# Altium schematic sheet Power.SchDoc
size A4; Author: T. Kreppel; CompanyName: Technische Universität München; Organization: TUM EAL; Address1: Arcisstraße 21; Address2: 80333 München; Address3: GERMANY; SheetNumber: 6; SheetTotal: 6; CompanyName2: Lehrstuhl für Elektrische Antriebsrechnik u. Leistungselektronik
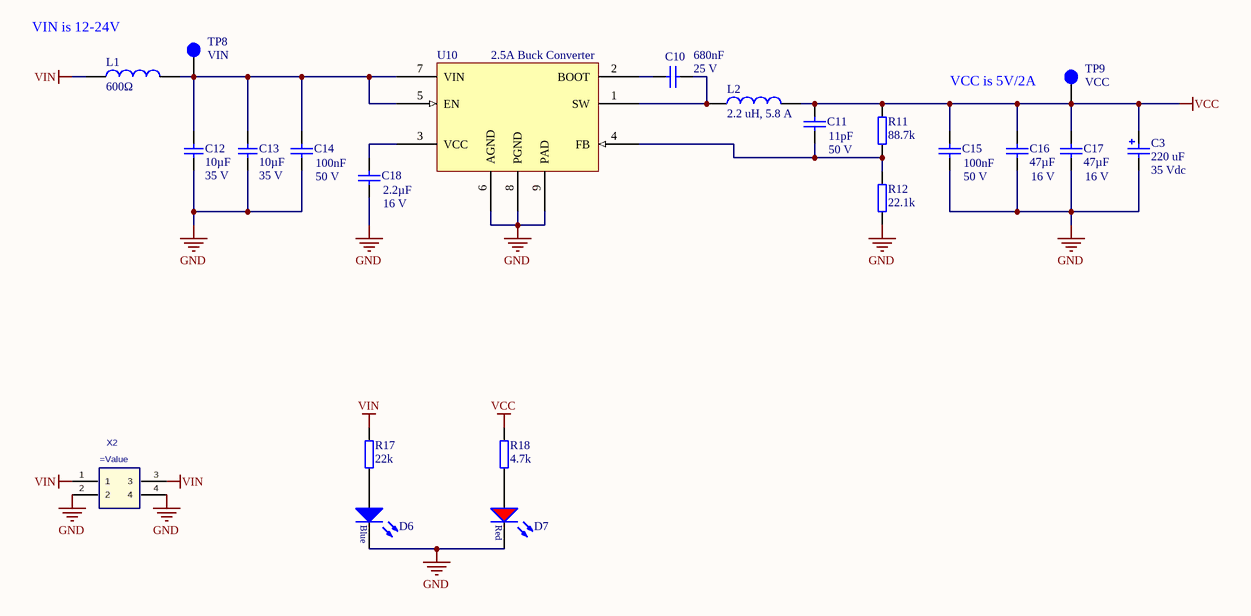
[diagram p0: Power.SchDoc]

## Parts
C3  220 uF  Voltage: 35 Vdc  [WCAP-ATG5_8x11.5x3.5]
C10  Voltage: 25 V  [C_0603(1608)100_L]  (hidden comment: 680nF)
C11  Voltage: 50 V  [C_0603(1608)100_L]  (hidden comment: 11pF)
C12  10µF  Voltage: 35 V  [C_1206]
C13  10µF  Voltage: 35 V  [C_1206]
C14  Voltage: 50 V  [C_0603(1608)100_L]  (hidden comment: 100nF)
C15  Voltage: 50 V  [C_0603(1608)100_L]  (hidden comment: 100nF)
C16  47µF  Voltage: 16 V  [C_1210_N]
C17  47µF  Voltage: 16 V  [C_1210_N]
C18  Voltage: 16 V  [C_0603(1608)100_L]  (hidden comment: 2.2µF)
D6  150060BS75000  [WL-SMCW_0603]  (value not drawn)
D7  150060RS75000  [WL-SMCW_0603]  (value not drawn)
L1  600Ω  [WE-CBF_0805_High Current]
L2  2.2 uH, 5.8 A  [SDC Inductor 4x4x2]
R11  88.7k  [R_0603_N]
R12  22.1k  [R_0603_N]
R17  22k  [R_0603_N]
R18  4.7k  [R_0603_N]
TP8  VIN  [TP_1mm]
TP9  VCC  [TP_1mm]
U10  2.5A Buck Converter  [SOP127P600X170_HS-9N]
X2  (no value)  [IPL1-102-01-L-D-K]

## Nets
GND: C3.2(N) C12.1 C13.1 C14.2 C15.1 C16.1 C17.1 C18.2 D6.1(K) D7.1(K) R12.1 U10.6(AGND) U10.8(PGND) U10.9(PAD) X2.2 X2.4
VCC: C3.1(P) C11.2 C15.2 C16.2 C17.2 L2.2 R11.2 R18.2 TP9.1
VIN: L1.1 R17.2 X2.1 X2.3
NetC10_1: C10.1 U10.2(BOOT)
NetC10_2: C10.2 L2.1 U10.1(SW)
NetC11_1: C11.1 R11.1 R12.2 U10.4(FB)
NetC12_2: C12.2 C13.2 C14.1 L1.2 TP8.1 U10.5(EN) U10.7(VIN)
NetC18_1: C18.1 U10.3(VCC)
NetD6_2: D6.2(A) R17.1
NetD7_2: D7.2(A) R18.1

## Notes on the sheet
- (near L1) VIN is 12-24V
- VCC is 5V/2A
- Title
- Size:
- Date:
- A4
- Revision:
- Time:
- Sheet
- of
- Author:
- Project:

## Library data of the parts
C3 = 860020574012: WCAP-ATG5 Aluminum Electrolytic Capacitors, 8x11.5mm, 35 Vdc, 220 uF; MF: Wurth Elektronik; ComponentLink1Description: Manufacturer; ComponentLink1URL: http://www.we-online.de; ComponentLink2Description: Datasheet; ComponentLink2URL: http://katalog.we-online.com/pbs/datasheet/860020574012.pdf; Part Number: 860020574012; Published Date: Sep. 2017; Size: 8x11.5mm; Life Cycle: 2000h; Operating Temperature: -40 °C up to +105 °C; Value: 220 uF; MPN: 860020574012; Supplier 1: Mouser; Supplier Part Number 1: 710-860020574012
C10 = C_0603: CAP 0603 (1608 Metric) SMD; MPN: 0603X684K250CT; Tolerance: ±10%; Case-Metric: 1608; Dielectric: X5R; Case-EIA: 0603; MF: Walsin; Max Thickness: 1 mm; Technology: SMT; Value: 680nF; Created: 2018_09_06_AGeiger; Supplier 1: Mouser; Supplier Part Number 1: 791-0603X684K250CT; Package: 0603
C11 = C_0603: CAP 0603 (1608 Metric) SMD; MPN: CC0603JRNPO9BN110; Tolerance: ±5%; Case-Metric: 1608; Dielectric: C0G; Case-EIA: 0603; MF: Yageo; Max Thickness: 1 mm; Technology: SMT; Value: 11pF; Created: 2018_09_06_AGeiger; Supplier 1: Mouser; Supplier Part Number 1: 603-CC603JRNPO9BN110; Package: 0603
C12 C13 = C_1206: Capacitor 1206; MPN: GMK316BJ106KL-T; Tolerance: 10%; MF: Taiyo Yuden; Dielectric: X5R; Package: 1206; Value: 10µF; Created: 2018_06_25_AGeiger; Supplier 1: Mouser; Supplier Part Number 1: 963-GMK316BJ106KL-T
C14 C15 = C_0603: CAP 0603 (1608 Metric) SMD; MPN: CC0603MRY5V9BB104; Tolerance: ±20%; Case-Metric: 1608; Dielectric: X5V; Case-EIA: 0603; MF: Yageo; Max Thickness: 0.8 mm; Technology: SMT; Value: 100nF; Created: 2018_09_06_AGeiger; Supplier 1: Mouser; Supplier Part Number 1: 603-C0603MRY5V9BB104; Package: 0603
C16 C17 = C_1210: Capacitor 1210; MPN: GRM32EC81C476ME15L; Dielectric: X6S; MF: Murata; Tolerance: 20%; Created: 2018_11_12_AGeiger; Package: 1210; Supplier 1: Mouser; Supplier Part Number 1: 81-GRM32EC81C476ME5L; Value: 47µF
C18 = C_0603: CAP 0603 (1608 Metric) SMD; MPN: EMK107BJ225KA-T; Tolerance: ±10%; Case-Metric: 1608; Dielectric: X5R; Case-EIA: 0603; MF: Taiyo Yuden; Max Thickness: 1 mm; Technology: SMT; Value: 2.2µF; Created: 2018_09_06_AGeiger; Supplier 1: Mouser; Supplier Part Number 1: 963-EMK107BJ225KA-T; Package: 0603
D6 = LED_Blue_0603: WL-SMCW SMD Mono-color Chip LED Waterclear, size 0603, Blue, 3.2 V, 140°; Forward Voltage: 3.2 V; Luminous Intensity: 145 mcd; Peak Wavelength: 465 nm; Dominant Wavelength: 470 nm; MF: Wuerth Elektronik; Published Date: Sep. 2017; ComponentLink1Description: Manufacturer; ComponentLink1URL: http://www.we-online.de; ComponentLink2Description: Datasheet; ComponentLink2URL: http://katalog.we-online.com/led/datasheet/150060BS75000.pdf; MPN: 150060BS75000; Size: 0603; Viewing Angle: 140°; Emitting Color: Blue; Value: 150060BS75000; Package: 0603; Created: 2018_09_06_AGeiger; Supplier 1: Farnell; Supplier Part Number 1: 2322069; Supplier 2: Mouser; Supplier Part Number 2: 710-150060BS75000; Supplier 3: Digi-Key; Supplier Part Number 3: 732-4966-1-ND
D7 = LED_Red_0603: WL-SMCW SMD Mono-color Chip LED Waterclear, size 0603, Red, 2 V, 140°; Forward Voltage: 2 V; Luminous Intensity: 250 mcd; Peak Wavelength: 630 nm; Dominant Wavelength: 625 nm; MF: Wuerth Elektronik; Published Date: Sep. 2017; ComponentLink1Description: Manufacturer; ComponentLink1URL: http://www.we-online.de; ComponentLink2Description: Datasheet; ComponentLink2URL: http://katalog.we-online.com/led/datasheet/150060RS75000.pdf; MPN: 150060RS75000; Size: 0603; Viewing Angle: 140°; Emitting Color: Red; Value: 150060RS75000; Package: 0603; Created: 2018_09_06_AGeiger; Supplier 1: Farnell; Supplier Part Number 1: 2322071; Supplier 2: Mouser; Supplier Part Number 2: 710-150060RS75000; Supplier 3: Digi-Key; Supplier Part Number 3: 732-4978-1-ND
L1 = WE-CBF, 742792040: WE-CBF SMD EMI Suppression Ferrite Bead, 0805, 600Ω; MF: Wurth Elektronik; Type: High Current; PublishedDate: Aug 2016; ComponentLink1Description: Manufacturer; ComponentLink1URL: http://www.we-online.de; ComponentLink2Description: Datasheet; ComponentLink2URL: http://katalog.we-online.de/pbs/datasheet/742792040.pdf; MPN: 742792040; Value: 600Ω; Size: 0805; Supplier 1: Farnell; Supplier 2: Mouser; Supplier 3: Digi-Key; Supplier Part Number 1: 2761567; Supplier Part Number 2: 710-742792040; Supplier Part Number 3: 732-1620-1-ND
L2 = PA4332.222NLT: SMT Shielded Tiny Power Inductor, size 4x4x2, 2.2 uH, 5.8 A; Rated Current: 5.8A; DC Resistance max.: 48 mOhm; Self Resonant Frequency: 25 MHz; Saturation Current: 6.1 A; Inductance: 2.2 uH; ComponentLink1Description: Manufacturer; ComponentLink1URL: http://www.we-online.de; ComponentLink2Description: Datasheet; ComponentLink2URL: https://katalog.we-online.com/pbs/datasheet/744031002.pdf; Part Number: PA4332.222NLT; Created: 2019_04_09_Kreppel; Publisher: Pulse Electronics; Size: 4x4x2; Operating Temperature: -40 to +125 degC; Mounting Technology: SMT; Packaging: Tape and Reel; Supplier 1: Mouser; Supplier 2: Digi-Key; Supplier Part Number 1: 673-PA4332222NLT; Supplier Part Number 2: 553-3290-1-ND
R11 = R_0603: SMD Resistor 0603; MPN: CRCW060388K7FKEB; Tolerance: 1%; Voltage: 75 V; Power: 100 mW; MF: Vishay; Package: 0603; Value: 88.7k; Created: 2018_09_06_AGeiger; Supplier 1: Mouser; Supplier Part Number 1: 71-CRCW060388K7FKEB
R12 = R_0603: SMD Resistor 0603; MPN: CRCW060322K1FKEA; Tolerance: 1%; Voltage: 75 V; Power: 100 mW; MF: Vishay; Package: 0603; Value: 22.1k; Created: 2018_09_06_AGeiger; Supplier 1: Mouser; Supplier Part Number 1: 71-CRCW0603-22.1K-E3
R17 = R_0603: SMD Resistor 0603; MPN: CRCW060322K0FKEAC; Tolerance: 1%; Voltage: 75V; Power: 100 mW; MF: Vishay; Package: 0603; Value: 22k; Created: 2018_09_06_AGeiger; Supplier 1: Mouser; Supplier Part Number 1: 71-CRCW060322K0FKEAC
R18 = R_0603: SMD Resistor 0603; MPN: CRCW06034K70JNEAC; Tolerance: 5%; Voltage: 75V; Power: 100 mW; MF: Vishay; Package: 0603; Value: 4.7k; Created: 2018_09_06_AGeiger; Supplier 1: Mouser; Supplier Part Number 1: 71-CRCW06034K70JNEAC
TP8 TP9 = TP_1mm: Testpoint 1mm; Created: 2018_06_25_AGeiger; Value: Testpoint 1mm
U10 = LMR23625: LMR23625 SIMPLE SWITCHER 4-36Vin, 2.5V synchronous step-down regulator; MPN: LMR23625CFDDAR; MF: Texas Instruments; Created: 2019_04_09_Kreppel; Supplier 1: Mouser; Supplier Part Number 1: 595-LMR23625CFDDAR; Value: *
X2 = IPL1-102-XX-X-D-X: 2.54mm Double Row Terminal Assembly, Right-Angled; Manufacturer: SAMTEC; Created: 2018_05_02_AGeiger; Value: =MPN; MPN: IPL1-102-01-L-D-K